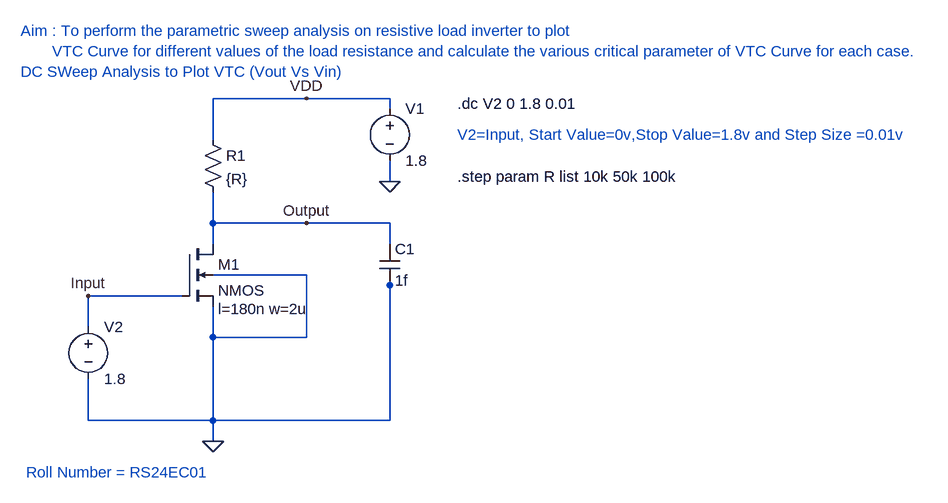
[diagram p0: schematic EXP1 VTC_Resistive_Inverter_find_Slop.asc]
EXP1 VTC_Resistive_Inverter_find_Slop.asc, the LTspice schematic file:
Version 4
SHEET 1 2496 680
WIRE 448 -112 304 -112
WIRE 576 -112 448 -112
WIRE 576 -96 576 -112
WIRE 304 -48 304 -112
WIRE 576 16 576 -16
WIRE 304 80 304 32
WIRE 448 80 304 80
WIRE 576 80 448 80
WIRE 304 112 304 80
WIRE 576 112 576 80
WIRE 448 160 304 160
WIRE 576 176 576 160
WIRE 256 192 112 192
WIRE 112 240 112 192
WIRE 304 256 304 208
WIRE 448 256 448 160
WIRE 448 256 304 256
WIRE 112 384 112 320
WIRE 304 384 304 256
WIRE 304 384 112 384
WIRE 576 384 576 176
WIRE 576 384 304 384
WIRE 304 416 304 384
FLAG 576 16 0
FLAG 304 416 0
FLAG 112 192 Input
FLAG 448 80 Output
FLAG 448 -112 VDD
SYMBOL res 288 -64 R0
SYMATTR InstName R1
SYMATTR Value {R}
SYMBOL cap 560 112 R0
SYMATTR InstName C1
SYMATTR Value 1f
SYMBOL voltage 576 -112 R0
WINDOW 123 0 0 Left 0
WINDOW 39 0 0 Left 0
SYMATTR InstName V1
SYMATTR Value 1.8
SYMBOL voltage 112 224 R0
WINDOW 123 0 0 Left 0
WINDOW 39 0 0 Left 0
SYMATTR InstName V2
SYMATTR Value 1.8
SYMBOL nmos4 256 112 R0
WINDOW 123 56 100 Left 2
SYMATTR Value2 l=180n w=2u
SYMATTR InstName M1
TEXT 8 -216 Left 2 ;Aim : To perform the parametric sweep analysis on resistive load inverter to plot   \n       VTC Curve for different values of the load resistance and calculate the various critical parameter of VTC Curve for each case. \nDC SWeep Analysis to Plot VTC (Vout Vs Vin)
TEXT 680 -104 Left 2 !.dc V2 0 1.8 0.01
TEXT 680 -56 Left 2 ;V2=Input, Start Value=0v,Stop Value=1.8v and Step Size =0.01v
TEXT 16 464 Left 2 ;Roll Number = RS24EC01
TEXT 680 8 Left 2 !.step param R list 10k 50k 100k

The netlist it stands for:
* EXP1 VTC_Resistive_Inverter_find_Slop.asc
R1 VDD Output {R}
C1 Output 0 1f
V1 VDD 0 1.8
V2 Input 0 1.8
M1 Output Input 0 0 NMOS l=180n w=2u
.model NMOS NMOS
.model PMOS PMOS
.lib standard.mos
* Aim : To perform the parametric sweep analysis on resistive load inverter to plot
*        VTC Curve for different values of the load resistance and calculate the various critical parameter of VTC Curve for each case.
* DC SWeep Analysis to Plot VTC (Vout Vs Vin)
.dc V2 0 1.8 0.01
* V2=Input, Start Value=0v,Stop Value=1.8v and Step Size =0.01v
* Roll Number = RS24EC01
.step param R list 10k 50k 100k
.backanno
.end

* Results of the author's LTspice run, read from the files saved beside the schematic
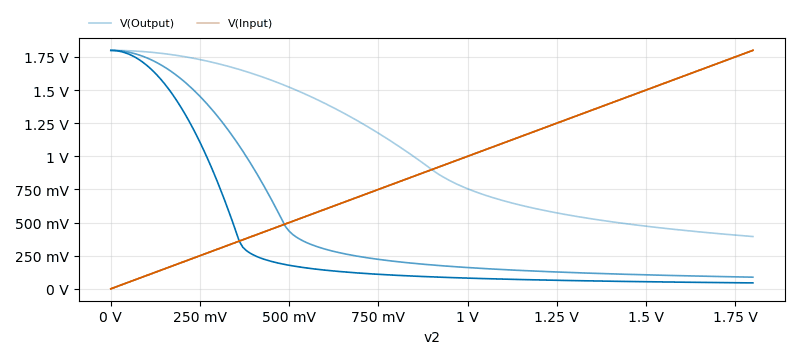
[diagram p1: DC transfer characteristic of EXP1 VTC_Resistive_Inverter_find_Slop.asc, plotted from the saved traces]
* DC transfer characteristic, 3 runs:
*   V(Output) [r=10000]: 1.8 V at v2=0 V, 394.6 mV at v2=1.8 V, min 394.6 mV, max 1.8 V
*   V(Output) [r=50000]: 1.8 V at v2=0 V, 87.75 mV at v2=1.8 V, min 87.75 mV, max 1.8 V
*   V(Output) [r=100000]: 1.8 V at v2=0 V, 44.44 mV at v2=1.8 V, min 44.44 mV, max 1.8 V
*   V(Input) [r=10000]: 0 V at v2=0 V, 1.8 V at v2=1.8 V, min 0 V, max 1.8 V
*   V(Input) [r=50000]: 0 V at v2=0 V, 1.8 V at v2=1.8 V, min 0 V, max 1.8 V
*   V(Input) [r=100000]: 0 V at v2=0 V, 1.8 V at v2=1.8 V, min 0 V, max 1.8 V